# EAGLE schematic Tayloe Detector v3 (EAGLE 9.1.2)
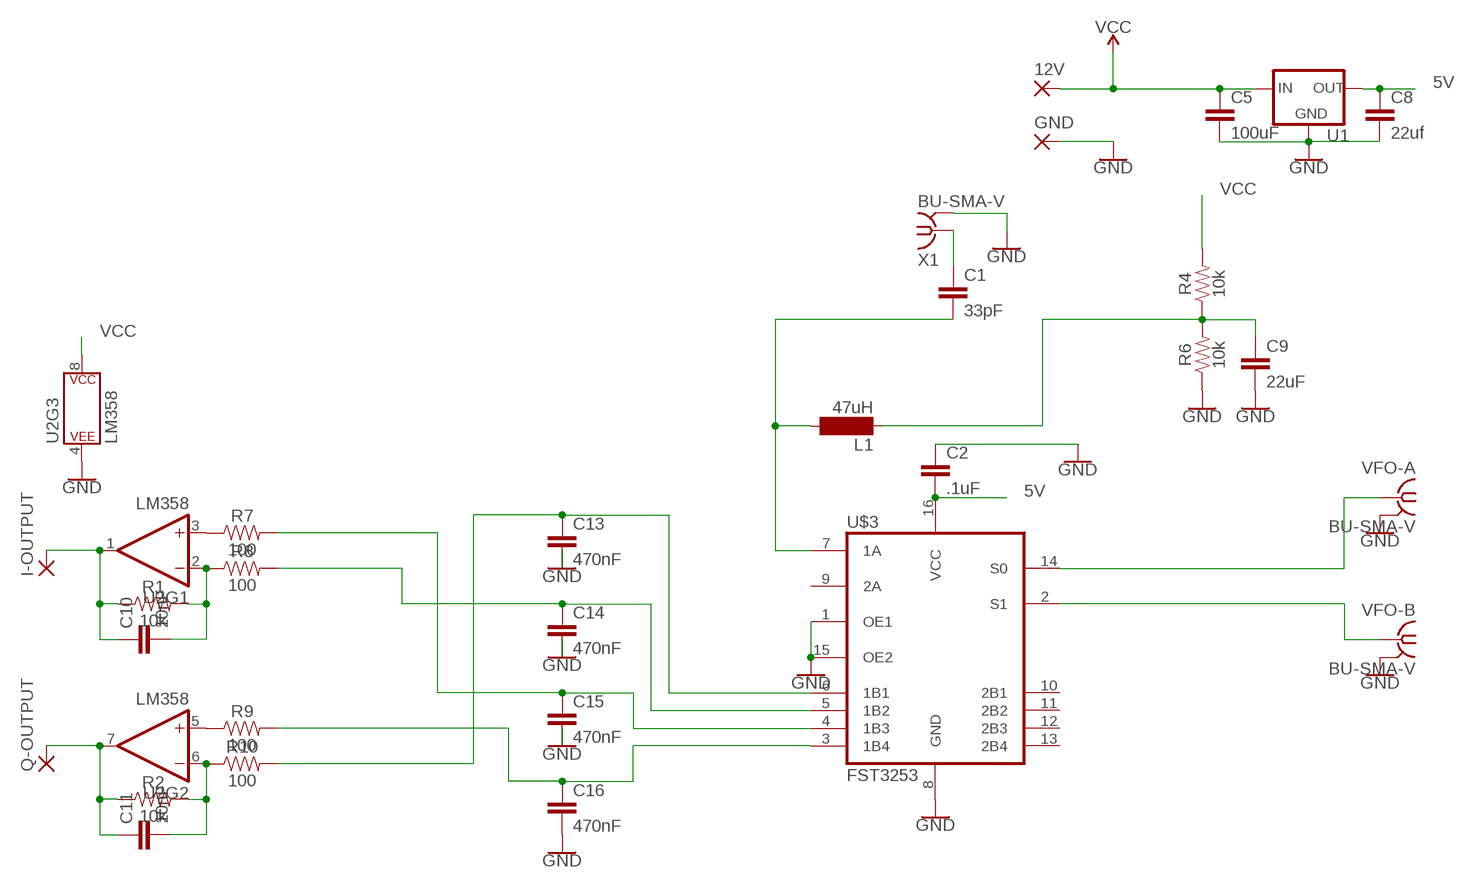
[diagram p0: schematic, sheet 1]

## Parts
12V  3,17/1,1  [3,17/1,1]
C1  33pF  C5/3.5  [C5B3.5]
C2  .1uF  C5/3.5  [C5B3.5]
C5  100uF  C5/3.5  [C5B3.5]
C8  22uf  C5/3.5  [C5B3.5]
C9  22uF  C5/3.5  [C5B3.5]
C10  10nF  C5/3.5  [C5B3.5]
C11  10nF  C5/3.5  [C5B3.5]
C13  470nF  C5/3.5  [C5B3.5]
C14  470nF  C5/3.5  [C5B3.5]
C15  470nF  C5/3.5  [C5B3.5]
C16  470nF  C5/3.5  [C5B3.5]
GND  3,17/1,1  [3,17/1,1]
I-OUTPUT  3,17/1,1  [3,17/1,1]
L1  47uH  BS75  [BS75]
Q-OUTPUT  3,17/1,1  [3,17/1,1]
R1  10k  1KOHM-HORIZ-1/4W-1%  [AXIAL-0.3]
R2  10k  1KOHM-HORIZ-1/4W-1%  [AXIAL-0.3]
R4  10k  1KOHM-HORIZ-1/4W-1%  [AXIAL-0.3]
R6  10k  1KOHM-HORIZ-1/4W-1%  [AXIAL-0.3]
R7  100  1KOHM-HORIZ-1/4W-1%  [AXIAL-0.3]
R8  100  1KOHM-HORIZ-1/4W-1%  [AXIAL-0.3]
R9  100  1KOHM-HORIZ-1/4W-1%  [AXIAL-0.3]
R10  100  1KOHM-HORIZ-1/4W-1%  [AXIAL-0.3]
U1  V_REG_78XXTO-92_UNTESTED  [TO-92]
U2  LM358  [DIP08]
U$3  FST3253  [SO16]
VFO-A  BU-SMA-V  [BU-SMA-V]
VFO-B  BU-SMA-V  [BU-SMA-V]
X1  BU-SMA-V  [BU-SMA-V]

## Nets
5V: C2.2 C8.1 U1.1(OUT) U$3.16(VCC)
GND: C2.1 C5.2 C8.2 C9.2 C13.2 C14.2 C15.2 C16.2 GND.1(P) R6.P$1 U1.2(GND) U2.4(P$V-) U$3.1(OE1) U$3.8(GND) U$3.15(OE2) VFO-A.2 VFO-A.3 VFO-A.4 VFO-A.5 VFO-B.2 VFO-B.3 VFO-B.4 VFO-B.5 X1.2 X1.3 X1.4 X1.5
N$1: C1.1 X1.1
N$2: R7.P$1 U2.3(+IN)
N$3: C9.1 L1.1 R4.P$1 R6.P$2
N$5: C1.2 L1.2 U$3.7(1A)
N$6: C10.2 R1.P$2 R8.P$1 U2.2(-IN)
N$8: R9.P$1 U2.5(+IN)
N$10: C10.1 I-OUTPUT.1(P) R1.P$1 U2.1(OUT)
N$11: C14.1 R8.P$2 U$3.5(1B2)
N$12: C11.2 R2.P$2 R10.P$1 U2.6(-IN)
N$13: C15.1 R7.P$2 U$3.4(1B3)
N$14: C13.1 R10.P$2 U$3.6(1B1)
N$15: U$3.14(S0) VFO-A.1
N$16: C11.1 Q-OUTPUT.1(P) R2.P$1 U2.7(OUT)
N$17: U$3.2(S1) VFO-B.1
N$18: C16.1 R9.P$2 U$3.3(1B4)
VCC: 12V.1(P) C5.1 R4.P$2 U1.3(IN) U2.8(P$V+)
Unconnected: U$3.9(2A) U$3.10(2B1) U$3.11(2B2) U$3.12(2B3) U$3.13(2B4)

## Library data of the parts
12V GND I-OUTPUT Q-OUTPUT = wirepad:3,17/1,1: THROUGH-HOLE PAD
C1 C2 C5 C8-C11 C13-C16 = capacitor-wima:C: CAPACITOR naming: grid - package width
L1 = inductor-neosid:BS: INDUCTOR nominal inductance, magnetically screened; OC_FARNELL: unknown; OC_NEWARK: unknown
R1 R2 R4 R6-R10 = SparkFun-Resistors:1KOHM: 1kΩ resistor A resistor is a passive two-terminal electrical component that implements electrical resistance as a circuit element. Resistors act to reduce current flow, and, at the same time, act to lower voltage levels within circuits. - Wikipedia; PROD_ID: RES-12182; VALUE: 1k
U1 = SparkFun-IC-Power:V_REG_78XX: Voltage Regulator Standard 78xx regulator. IGO (Input Ground Output). Spark Fun Electronics SKU : COM-00107
U2 = SparkFun-IC-Amplifiers:LM358: LM358 Jellybean op-amp Datasheet <http://www.sparkfun.com/datasheets/Components/General/LM358.pdf> SparkFun Products Op-Amp (Thru-Hole) - LM358 <https://www.sparkfun.com/products/9456> (COM-09456); PROD_ID: IC-09172
U$3 = SparkFun-IC-Comms:FST3253: The Fairchild Switch FST3253 is a dual 4:1 high-speed CMOS TTL-compatible multiplexer/demultiplexer bus switch. The low on resistance of the switch allows inputs to be connected to outputs without adding propagation delay or generating additional ground bounce noise. When OE is LOW, S0 and S1 connect the A Port to the selected B Port output. When OE is HIGH, the switch is OPEN and a high-impedance state exists between the two
VFO-A VFO-B X1 = con-coax:BU-SMA-V: FEMALE SMA CONNECTOR Radiall distributor RS 112-3794; OC_FARNELL: unknown; OC_NEWARK: unknown

## Net classes
0 default: width 0.762 mm, drill 0.762 mm, clearance 0.508 mm